# Altium schematic sheet QCopterFC_MAIN_Sch.SchDoc
size A4; PageSetup: Record=PageOptions|CenterHorizontal=True|CenterVertical=True|PrintScale=1.00|XCorrection=1.00|YCorrection=1.00|PrintKind=0|BorderSize=5000000|LeftOffset=0|BottomOffset=0|Orientation=2|PaperLength=1000|PaperWidth=1000|Scale=100|PaperSource=7|PrintQuality=-4|MediaType=1|DitherType=10|PaperKind=A4|PrintScaleMode=1
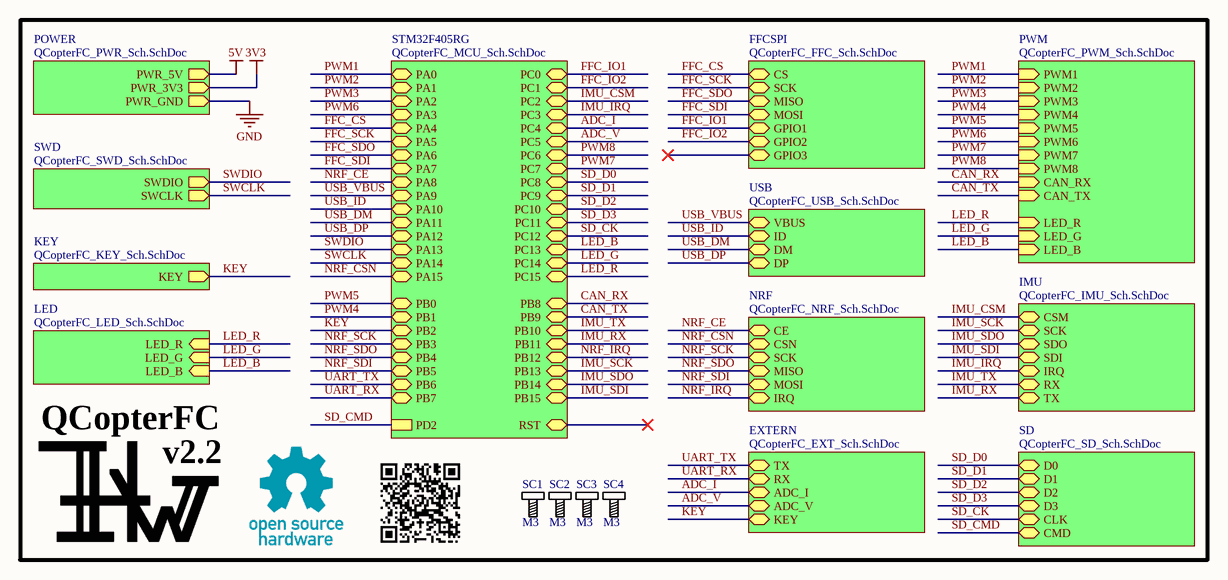
[diagram p0: QCopterFC_MAIN_Sch.SchDoc]

## Parts
HW  HW  [Logo_HW_v2.0]  (value not drawn)
ORCODE  ORCODE  (value not drawn)
OSHW  OSHW  (value not drawn)
SC1  M3  [SCRREW_M3]
SC2  M3  [SCRREW_M3]
SC3  M3  [SCRREW_M3]
SC4  M3  [SCRREW_M3]

## Blocks framed on the sheet
v2.2: ORCODE OSHW SC1-SC4
QCopterFC: HW

## Sub-sheets
EXTERN = QCopterFC_EXT_Sch.SchDoc: ADC_I, ADC_V, TX, RX, KEY
FFCSPI = QCopterFC_FFC_Sch.SchDoc: MISO, CS, MOSI, SCK, GPIO1, GPIO2, GPIO3
IMU = QCopterFC_IMU_Sch.SchDoc: RX, TX, SDO, SCK, SDI, IRQ, CSM
KEY = QCopterFC_KEY_Sch.SchDoc: KEY (out)
LED = QCopterFC_LED_Sch.SchDoc: LED_R (in), LED_G (in), LED_B (in)
NRF = QCopterFC_NRF_Sch.SchDoc: MISO, MOSI, SCK, CSN, CE, IRQ
POWER = QCopterFC_PWR_Sch.SchDoc: PWR_3V3 (out), PWR_5V (out), PWR_GND (out)
PWM = QCopterFC_PWM_Sch.SchDoc: PWM1 (in), PWM2 (in), PWM3 (in), PWM4 (in), PWM5 (in), PWM6 (in), PWM7 (in), PWM8 (in), CAN_RX (in), CAN_TX (in), LED_R (in), LED_G (in), LED_B (in)
SD = QCopterFC_SD_Sch.SchDoc: D0, CMD, D1, D2, D3, CLK
STM32F405RG = QCopterFC_MCU_Sch.SchDoc: PA0, PA1, PA2, PA3, PA4, PA5, PA6, PA7, PA8, PA9, PA10, PA11, PA12, PA13, PA14, PA15, PB0, PB1, PB2, PB3, PB4, PB5, PB6, PB7, PB8, PB9, PB10, PB11, PB12, PB13, PB14, PB15, PC0, PC1, PC2, PC3, PC4, PC5, PC6, PC7, PC8, PC9, PC10, PC11, PC12, PC13, PC14, PC15, PD2, RST
SWD = QCopterFC_SWD_Sch.SchDoc: SWDIO (out), SWCLK (out)
USB = QCopterFC_USB_Sch.SchDoc: VBUS, ID, DM, DP

## Nets
3V3: sheet POWER/PWR_3V3
5V: sheet POWER/PWR_5V
GND: sheet POWER/PWR_GND
ADC_I: sheet STM32F405RG/PC4, sheet EXTERN/ADC_I
ADC_V: sheet STM32F405RG/PC5, sheet EXTERN/ADC_V
CAN_RX: sheet PWM/CAN_RX, sheet STM32F405RG/PB8
CAN_TX: sheet PWM/CAN_TX, sheet STM32F405RG/PB9
FFC_CS: sheet FFCSPI/CS, sheet STM32F405RG/PA4
FFC_IO1: sheet FFCSPI/GPIO1, sheet STM32F405RG/PC0
FFC_IO2: sheet FFCSPI/GPIO2, sheet STM32F405RG/PC1
FFC_SCK: sheet FFCSPI/SCK, sheet STM32F405RG/PA5
FFC_SDI: sheet FFCSPI/MOSI, sheet STM32F405RG/PA7
FFC_SDO: sheet FFCSPI/MISO, sheet STM32F405RG/PA6
IMU_CSM: sheet IMU/CSM, sheet STM32F405RG/PC2
IMU_IRQ: sheet IMU/IRQ, sheet STM32F405RG/PC3
IMU_RX: sheet IMU/TX, sheet STM32F405RG/PB11
IMU_SCK: sheet IMU/SCK, sheet STM32F405RG/PB13
IMU_SDI: sheet IMU/SDI, sheet STM32F405RG/PB15
IMU_SDO: sheet IMU/SDO, sheet STM32F405RG/PB14
IMU_TX: sheet IMU/RX, sheet STM32F405RG/PB10
KEY: sheet KEY/KEY, sheet STM32F405RG/PB2, sheet EXTERN/KEY
LED_B: sheet LED/LED_B, sheet PWM/LED_B, sheet STM32F405RG/PC13
LED_G: sheet LED/LED_G, sheet PWM/LED_G, sheet STM32F405RG/PC14
LED_R: sheet LED/LED_R, sheet PWM/LED_R, sheet STM32F405RG/PC15
NRF_CE: sheet NRF/CE, sheet STM32F405RG/PA8
NRF_CSN: sheet NRF/CSN, sheet STM32F405RG/PA15
NRF_IRQ: sheet NRF/IRQ, sheet STM32F405RG/PB12
NRF_SCK: sheet NRF/SCK, sheet STM32F405RG/PB3
NRF_SDI: sheet NRF/MOSI, sheet STM32F405RG/PB5
NRF_SDO: sheet NRF/MISO, sheet STM32F405RG/PB4
PWM1: sheet PWM/PWM1, sheet STM32F405RG/PA0
PWM2: sheet PWM/PWM2, sheet STM32F405RG/PA1
PWM3: sheet PWM/PWM3, sheet STM32F405RG/PA2
PWM4: sheet PWM/PWM4, sheet STM32F405RG/PB1
PWM5: sheet PWM/PWM5, sheet STM32F405RG/PB0
PWM6: sheet PWM/PWM6, sheet STM32F405RG/PA3
PWM7: sheet PWM/PWM7, sheet STM32F405RG/PC7
PWM8: sheet PWM/PWM8, sheet STM32F405RG/PC6
SD_CK: sheet STM32F405RG/PC12, sheet SD/CLK
SD_CMD: sheet STM32F405RG/PD2, sheet SD/CMD
SD_D0: sheet STM32F405RG/PC8, sheet SD/D0
SD_D1: sheet STM32F405RG/PC9, sheet SD/D1
SD_D2: sheet STM32F405RG/PC10, sheet SD/D2
SD_D3: sheet STM32F405RG/PC11, sheet SD/D3
SWCLK: sheet SWD/SWCLK, sheet STM32F405RG/PA14
SWDIO: sheet SWD/SWDIO, sheet STM32F405RG/PA13
UART_RX: sheet STM32F405RG/PB7, sheet EXTERN/RX
UART_TX: sheet STM32F405RG/PB6, sheet EXTERN/TX
USB_DM: sheet STM32F405RG/PA11, sheet USB/DM
USB_DP: sheet STM32F405RG/PA12, sheet USB/DP
USB_ID: sheet STM32F405RG/PA10, sheet USB/ID
USB_VBUS: sheet STM32F405RG/PA9, sheet USB/VBUS

## Library data of the parts
HW = HW: Logo
ORCODE = ORCODE: Logo
OSHW = OSHW: Logo
SC1-SC4 = Screw_M3: Screw